# Altium project SKAR_chwytak.PrjPcb
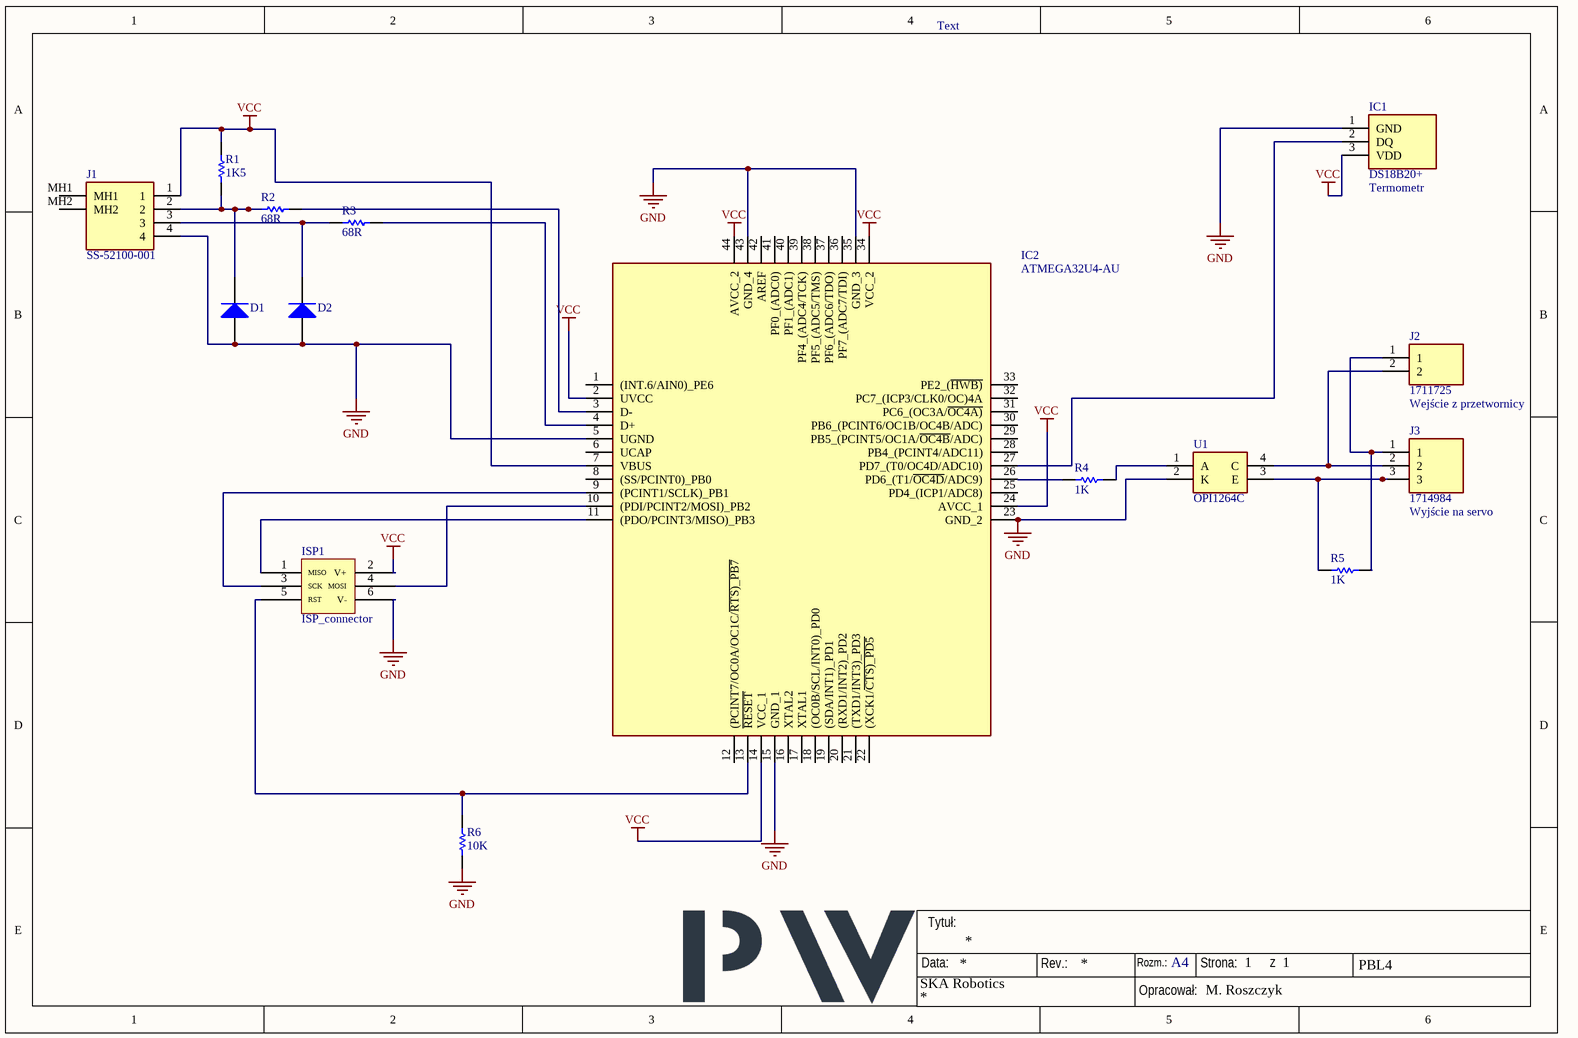
[diagram p0: Sheet1.SchDoc]
1 sheet, 15 parts. Net scope: global (net labels, ports and power ports of the same name join across sheets).
Board file: SKAR_chwytakfile.PcbDoc

## Sheet Sheet1.SchDoc
size 292 x 193 mm; ApprovedBy: A. Jelinski; CheckedBy: A. Jelinski; Author: M. Roszczyk; CompanyName: SKA Robotics; DrawnBy: M. Roszczyk; SheetNumber: 1; SheetTotal: 1

### Parts
D1  Diode  (value not drawn)
D2  Diode  (value not drawn)
IC1  DS18B20+  [DS18B20]
IC2  ATMEGA32U4-AU  [QFP80P1200X1200X120-44N]
ISP1  ISP_connector
J1  SS-52100-001  [SS52100001]
J2  1711725  [1711725]
J3  1714984  [1714984]
R1  value 1K5  (hidden comment: Resistor)
R2  value 68R  (hidden comment: Resistor)
R3  value 68R  (hidden comment: Resistor)
R4  value 1K  (hidden comment: Resistor)
R5  value 1K  (hidden comment: Resistor)
R6  10K  [AXIAL-0.3]
U1  OPI1264C  [OPI1264C]

### Nets
GND: D1.1(A) D2.1(A) IC1.1(GND) IC2.5(UGND) IC2.15(GND_1) IC2.23(GND_2) IC2.35(GND_3) IC2.43(GND_4) ISP1.6(V-) J1.4 R6.1 U1.2(K)
VCC: IC1.3(VDD) IC2.2(UVCC) IC2.7(VBUS) IC2.14(VCC_1) IC2.24(AVCC_1) IC2.34(VCC_2) IC2.44(AVCC_2) ISP1.2(V+) J1.1 R1.2
NetD1_2: D1.2(K) J1.2 R1.1 R2.1
NetD2_2: D2.2(K) J1.3 R3.1
NetIC1_2: IC1.2(DQ) IC2.27(PD7_(T0/OC4D/ADC10))
NetIC2_3: IC2.3(D-) R2.2
NetIC2_4: IC2.4(D+) R3.2
NetIC2_9: IC2.9((PCINT1/SCLK)_PB1) ISP1.3(SCK)
NetIC2_10: IC2.10((PDI/PCINT2/MOSI)_PB2) ISP1.4(MOSI)
NetIC2_11: IC2.11((PDO/PCINT3/MISO)_PB3) ISP1.1(MISO)
NetIC2_13: IC2.13(~{RESET}) ISP1.5(RST) R6.2
NetIC2_26: IC2.26(PD6_(T1/~{OC4D}/ADC9)) R4.1
NetJ2_1: J2.1 J3.1 R5.2
NetJ2_2: J2.2 J3.2 U1.4(C)
NetJ3_3: J3.3 R5.1 U1.3(E)
NetR4_2: R4.2 U1.1(A)

Not connected (* = marked no-connect by the designer): IC2 1((INT.6/AIN0)_PE6) 6(UCAP) 8((SS/PCINT0)_PB0) 12((PCINT7/OC0A/OC1C/~{RTS)_PB7}) 16(XTAL2) 17(XTAL1) 18((OC0B/SCL/INT0)_PD0) 19((SDA/INT1)_PD1) 20((RXD1/INT2)_PD2) 21((TXD1/INT3)_PD3) 22((XCK1/~{CTS)_PD5}) 25(PD4_(ICP1/ADC8)) 28(PB4_(PCINT4/ADC11)) 29(PB5_(PCINT5/OC1A/~{OC4B}/ADC)) 30(PB6_(PCINT6/OC1B/OC4B/ADC)) 31(PC6_(OC3A/~{OC4A)}) 32(PC7_(ICP3/CLK0/OC)4A) 33(PE2_(~{HWB)}) 36(PF7_(ADC7/TDI)) 37(PF6_(ADC6/TDO)) 38(PF5_(ADC5/TMS)) 39(PF4_(ADC4/TCK)) 40(PF1_(ADC1)) 41(PF0_(ADC0)) 42(AREF); J1 MH1 MH2

### Notes on the sheet
- Text
- (near IC1) Termometr
- Wejście z przetwornicy
- (near J3) Wyjście na servo
- Data:
- Tytuł:
- Rev.:
- Rozm.:
- A4
- Strona:
- z
- PBL4
- Opracował:

### Library data of the parts
D1 D2 = Diode: AF: 1; BV: 0; BV_MAX: 1e99; EG: 1.11; FC: 0.5; IBV: 0.001; ISR: 1e-14; MJSW: 0.33; NTUN: 30; TNOM: 27; XTI: 3; SimulationGenericComponent: True; CJO: 0; CJP: 0; CTA: 0; CTP: 0; FCS: 0.5; FV_MAX: 1e99; IKF: 0; IKR: 0; JSW: 0; JTUN: 0; JTUNSW: 0; KEG: 1; KF: 0; LEVEL: 1; N: 1; NBV: 1; NR: 1; NS: 1; PHP: 1; RS: 0; TCV: 0; TLEV: 0; TLEVC: 0; TM1: 0; TM2: 0; TPB: 0; TPHP: 0; TRS: 0; TRS2: 0; TT: 0; TTT1: 0; TTT2: 0; VJ: 1; XTITUN: 3; IS: 1e-14
IC1 = DS18B20+: Integrated Circuit; Manufacturer_Name: Analog Devices; Datasheet Link: https://ms.componentsearchengine.com/Datasheets/2/DS18B20+.pdf; Height: 4.95mm; Manufacturer_Part_Number: DS18B20+; Mouser Part Number: 700-DS18B20+; Mouser Price/Stock: https://www.mouser.co.uk/ProductDetail/Maxim-Integrated/DS18B20%2b?qs=7H2Jq%252ByxpJKegCKabDbglA%3D%3D; Arrow Part Number: DS18B20+; Arrow Price/Stock: https://www.arrow.com/en/products/ds18b20/maxim-integrated?region=nac
IC2 = ATMEGA32U4-AU: Integrated Circuit; Manufacturer_Name: Microchip; Datasheet Link: http://www.atmel.com/images/atmel-7766-8-bit-avr-atmega16u4-32u4_summary.pdf; Height: 1.2mm; Manufacturer_Part_Number: ATMEGA32U4-AU; Mouser Part Number: 556-ATMEGA32U4-AU; Mouser Price/Stock: https://www.mouser.co.uk/ProductDetail/Microchip-Technology-Atmel/ATMEGA32U4-AU?qs=SSucg2PyLi7mKWjHIsNJ3w%3D%3D; Arrow Part Number: ATMEGA32U4-AU; Arrow Price/Stock: https://www.arrow.com/en/products/atmega32u4-au/microchip-technology?region=nac
J1 = SS-52100-001: Connector; Manufacturer_Name: Bel; Datasheet Link: https://www.mouser.com/datasheet/2/643/bel_SS-52100-001-1216592.pdf; Height: 7.9mm; Manufacturer_Part_Number: SS-52100-001; Mouser Part Number: 530-SS-52100-001
J2 = 1711725: Connector; Manufacturer_Name: Phoenix Contact; Datasheet Link: http://www.phoenixcontact.net/product/1711725; Height: 18.2mm; Manufacturer_Part_Number: 1711725; Mouser Part Number: 651-1711725; Mouser Price/Stock: https://www.mouser.co.uk/ProductDetail/Phoenix-Contact/1711725?qs=F79NelsxgYFLEb9U5DotcA%3D%3D; Arrow Part Number: 1711725; Arrow Price/Stock: https://www.arrow.com/en/products/1711725/phoenix-contact?region=nac
J3 = 1714984: Connector; Manufacturer_Name: Phoenix Contact; Datasheet Link: https://www.phoenixcontact.com/online/portal/us/?uri=pxc-oc-itemdetail:pid=1714984&library=usen&pcck=P-11-01-05&tab=1&selectedCategory=ALL; Height: 21.7mm; Manufacturer_Part_Number: 1714984; Mouser Part Number: 651-1714984; Mouser Price/Stock: https://www.mouser.co.uk/ProductDetail/Phoenix-Contact/1714984?qs=cyzODkzcbwBLTTPxtXl6gQ%3D%3D; Arrow Part Number: 1714984; Arrow Price/Stock: https://www.arrow.com/en/products/1714984/phoenix-contact?region=nac
R1-R5 = Resistor: TC1: 0; SimulationGenericComponent: True; TC2: 0
R6 = Res1: Resistor; Value: K; Published: 8-Jun-2000; LatestRevisionDate: 17-Jul-2002; LatestRevisionNote: Re-released for DXP Platform.; PackageReference: AXIAL-0.3; Publisher: Altium Limited; PackageDescription: Axial Device, Thru-Hole; 2 Leads; 0.3 in Pin Spacing
U1 = OPI1264C: Undefined or Miscellaneous; Manufacturer_Name: OPTEK TECHNOLOGY; Datasheet Link: https://datasheet.datasheetarchive.com/originals/distributors/Datasheets-12/DSA-226019.pdf; Height: 5mm; Manufacturer_Part_Number: OPI1264C; Mouser Part Number: 828-OPI1264C; Mouser Price/Stock: https://www.mouser.com/Search/Refine.aspx?Keyword=828-OPI1264C; Arrow Part Number: OPI1264C; Arrow Price/Stock: https://www.arrow.com/en/products/opi1264c/optek-technology